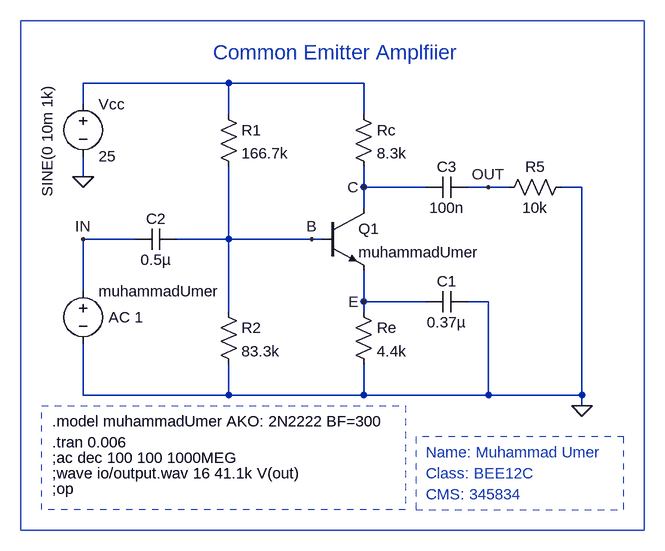
[diagram p0: schematic single_stage.asc]
single_stage.asc, the LTspice schematic file:
Version 4
SHEET 1 2160 688
WIRE 96 -192 -128 -192
WIRE 304 -192 96 -192
WIRE -128 -160 -128 -192
WIRE 96 -144 96 -192
WIRE 304 -144 304 -192
WIRE -128 -48 -128 -80
WIRE 304 -32 304 -64
WIRE 400 -32 304 -32
WIRE 496 -32 464 -32
WIRE 528 -32 496 -32
WIRE 640 -32 608 -32
WIRE 304 0 304 -32
WIRE -48 48 -128 48
WIRE 96 48 96 -64
WIRE 96 48 16 48
WIRE 224 48 96 48
WIRE 240 48 224 48
WIRE -128 128 -128 48
WIRE 304 144 304 96
WIRE 400 144 304 144
WIRE 496 144 464 144
WIRE 96 160 96 48
WIRE 304 160 304 144
WIRE -128 288 -128 208
WIRE 96 288 96 240
WIRE 96 288 -128 288
WIRE 304 288 304 240
WIRE 304 288 96 288
WIRE 496 288 496 144
WIRE 496 288 304 288
WIRE 640 288 640 -32
WIRE 640 288 496 288
WIRE 640 304 640 288
FLAG -128 -48 0
FLAG -128 48 IN
FLAG 304 -32 C
FLAG 304 144 E
FLAG 224 48 B
FLAG 496 -32 OUT
FLAG 640 304 0
SYMBOL npn 240 0 R0
SYMATTR InstName Q1
SYMATTR Value muhammadUmer
SYMBOL res 288 144 R0
SYMATTR InstName Re
SYMATTR Value 4.4k
SYMBOL res 80 -160 R0
SYMATTR InstName R1
SYMATTR Value 166.7k
SYMBOL res 80 144 R0
SYMATTR InstName R2
SYMATTR Value 83.3k
SYMBOL res 288 -160 R0
SYMATTR InstName Rc
SYMATTR Value 8.3k
SYMBOL res 624 -48 R90
WINDOW 0 0 56 VBottom 2
WINDOW 3 32 56 VTop 2
SYMATTR InstName R5
SYMATTR Value 10k
SYMBOL cap 464 128 R90
WINDOW 0 0 32 VBottom 2
WINDOW 3 32 32 VTop 2
SYMATTR InstName C1
SYMATTR Value 0.37µ
SYMBOL cap 16 32 R90
WINDOW 0 0 32 VBottom 2
WINDOW 3 32 32 VTop 2
SYMATTR InstName C2
SYMATTR Value 0.5µ
SYMBOL cap 464 -48 R90
WINDOW 0 0 32 VBottom 2
WINDOW 3 32 32 VTop 2
SYMATTR InstName C3
SYMATTR Value 100n
SYMBOL voltage -128 112 R0
WINDOW 3 -55 -301 VRight 2
WINDOW 123 39 56 Left 2
WINDOW 39 0 0 Left 0
SYMATTR Value SINE(0 10m 1k)
SYMATTR Value2 AC 1
SYMATTR InstName muhammadUmer
SYMBOL voltage -128 -176 R0
SYMATTR InstName Vcc
SYMATTR Value 25
TEXT -176 328 Left 2 !.model muhammadUmer AKO: 2N2222 BF=300
TEXT 72 -240 Left 3 ;Common Emitter Amplfiier
TEXT 400 376 Left 2 ;Name: Muhammad Umer
TEXT 400 408 Left 2 ;Class: BEE12C
TEXT 400 440 Left 2 ;CMS: 345834
TEXT -176 360 Left 2 !.tran 0.006
TEXT -176 384 Left 2 !;ac dec 100 100 1000MEG
TEXT -176 408 Left 2 !;wave io/output.wav 16 41.1k V(out)
TEXT -176 432 Left 2 !;op
RECTANGLE Normal 704 352 384 464 1
RECTANGLE Normal 368 464 -192 304 1
RECTANGLE Normal 736 -288 -224 496

The netlist it stands for:
* single_stage.asc
Q1 C B E 0 muhammadUmer
Re E 0 4.4k
R1 N001 B 166.7k
R2 B 0 83.3k
Rc N001 C 8.3k
R5 0 OUT 10k
C1 0 E 0.37µ
C2 B IN 0.5µ
C3 OUT C 100n
V§muhammadUmer IN 0 SINE(0 10m 1k) AC 1
Vcc N001 0 25
.model NPN NPN
.model PNP PNP
.lib standard.bjt
.model muhammadUmer AKO: 2N2222 BF=300
* Common Emitter Amplfiier
* Name: Muhammad Umer
* Class: BEE12C
* CMS: 345834
.tran 0.006
;ac dec 100 100 1000MEG
;wave io/output.wav 16 41.1k V(out)
;op
.backanno
.end

* Results of the author's LTspice run, read from the files saved beside the schematic
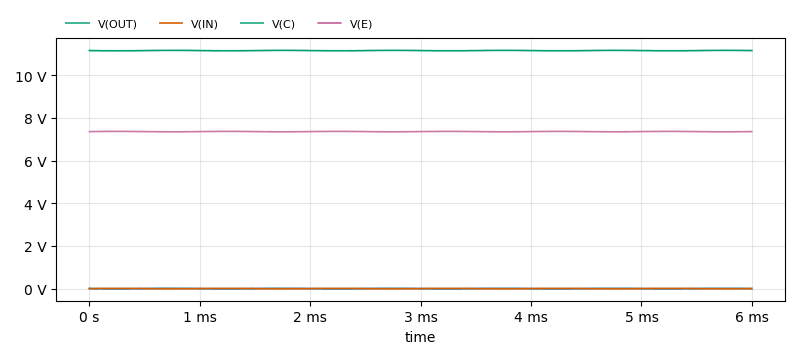
[diagram p1: Transient Analysis of single_stage.asc, plotted from the saved traces]
* Transient Analysis, 1 run:
*   V(OUT): min -10.12 mV, max 10.53 mV, average 158.3 µV, rms 7.031 mV, last -917.9 µV
*   V(IN): min -9.983 mV, max 9.986 mV, average 8.524 µV, rms 6.92 mV, last 0 V
*   V(C): min 11.15 V, max 11.17 V, average 11.16 V, rms 11.16 V, last 11.16 V
*   V(E): min 7.351 V, max 7.371 V, average 7.361 V, rms 7.361 V, last 7.361 V